# Altium schematic sheet BREADBOARD_MATTRIX.SchDoc
size A2; SheetNumber: 3; SheetTotal: 15
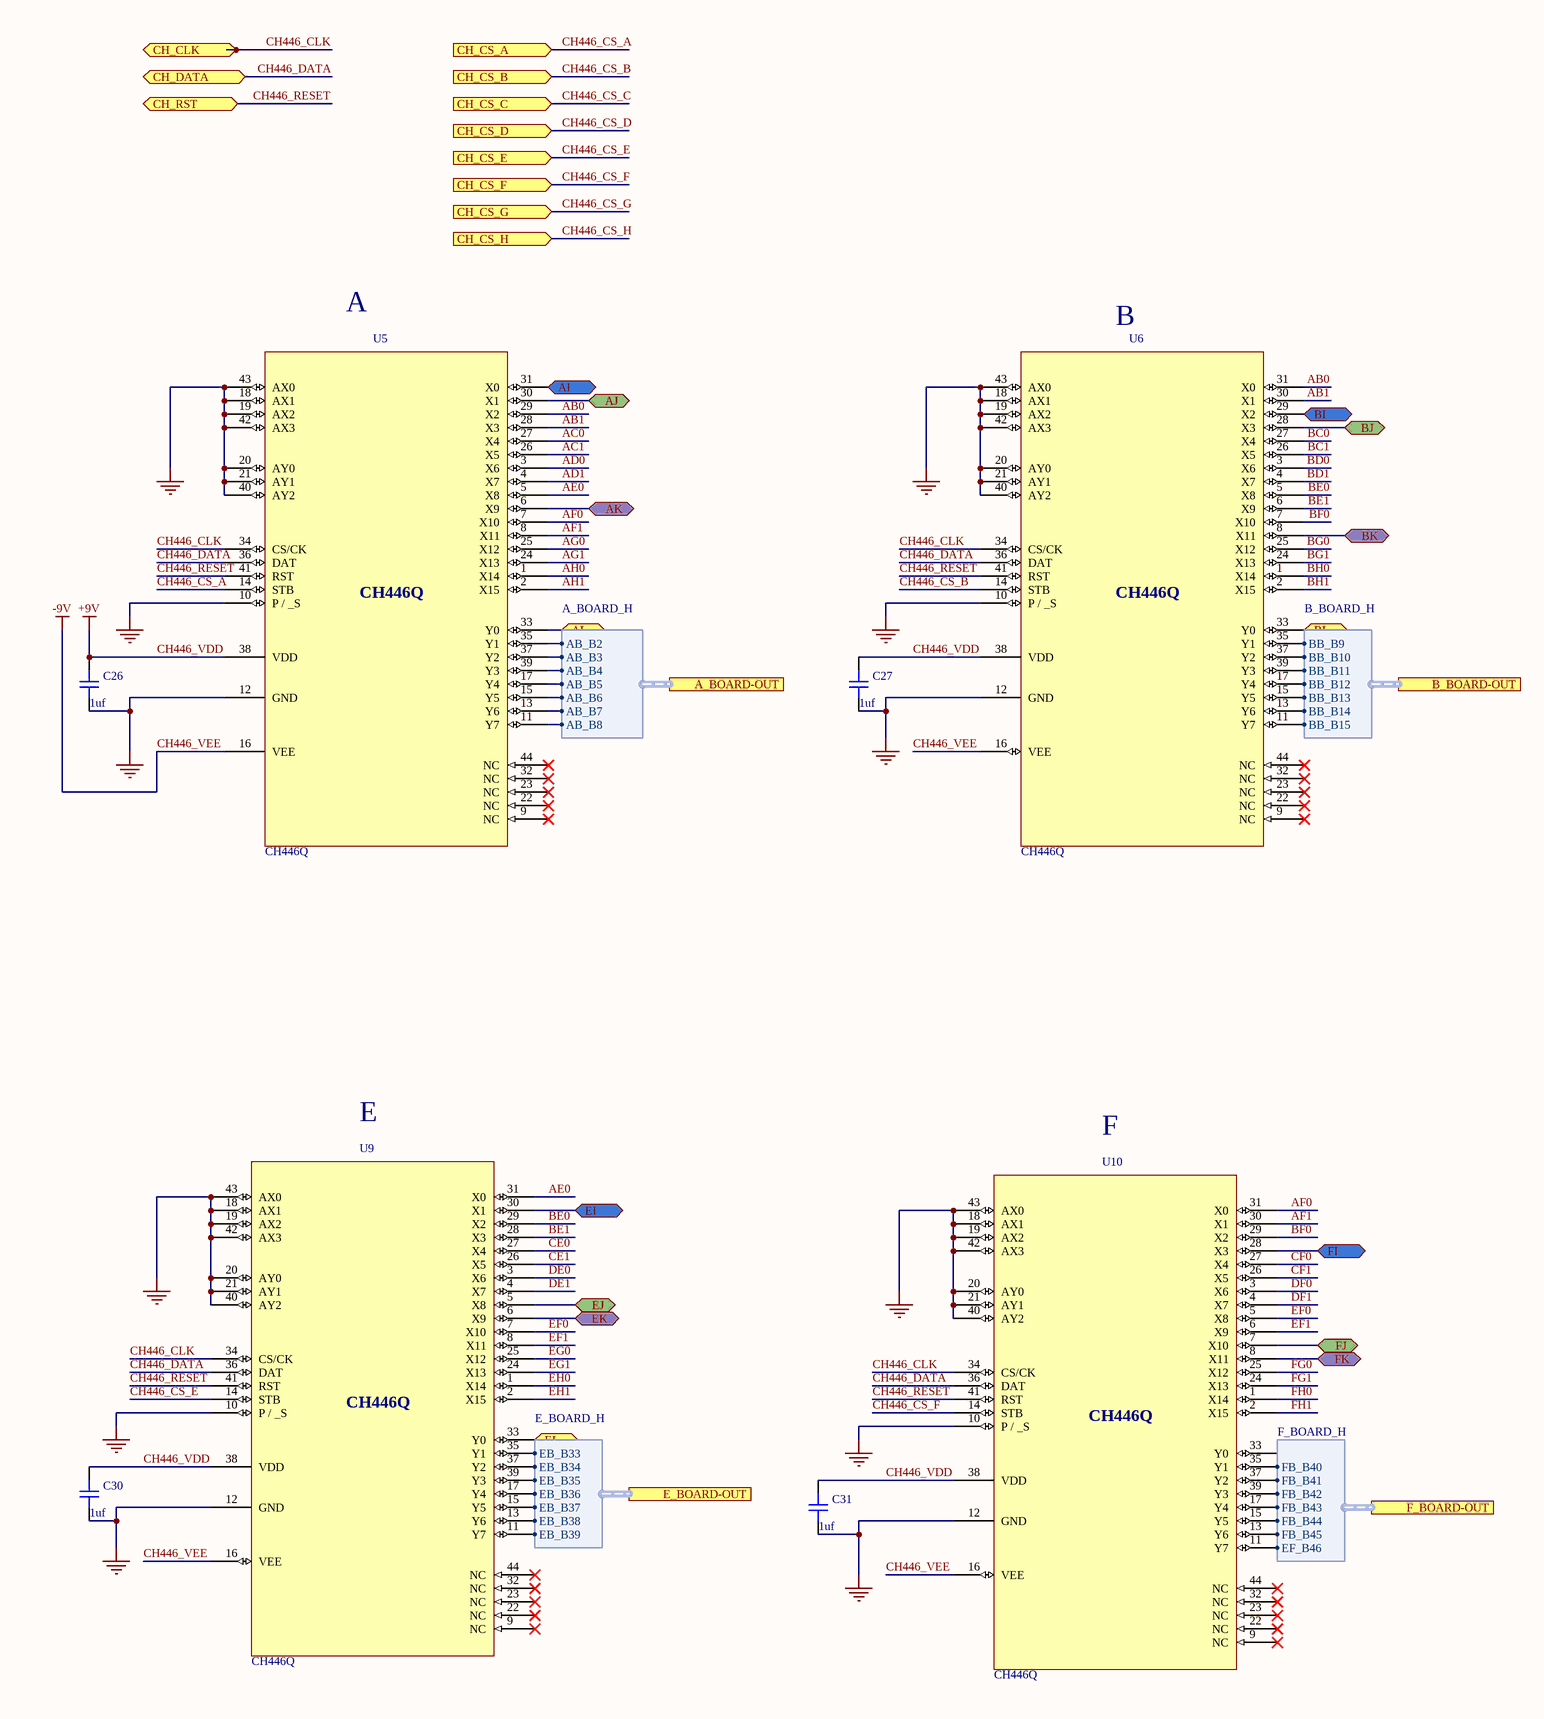
[diagram p0: BREADBOARD_MATTRIX.SchDoc, left]
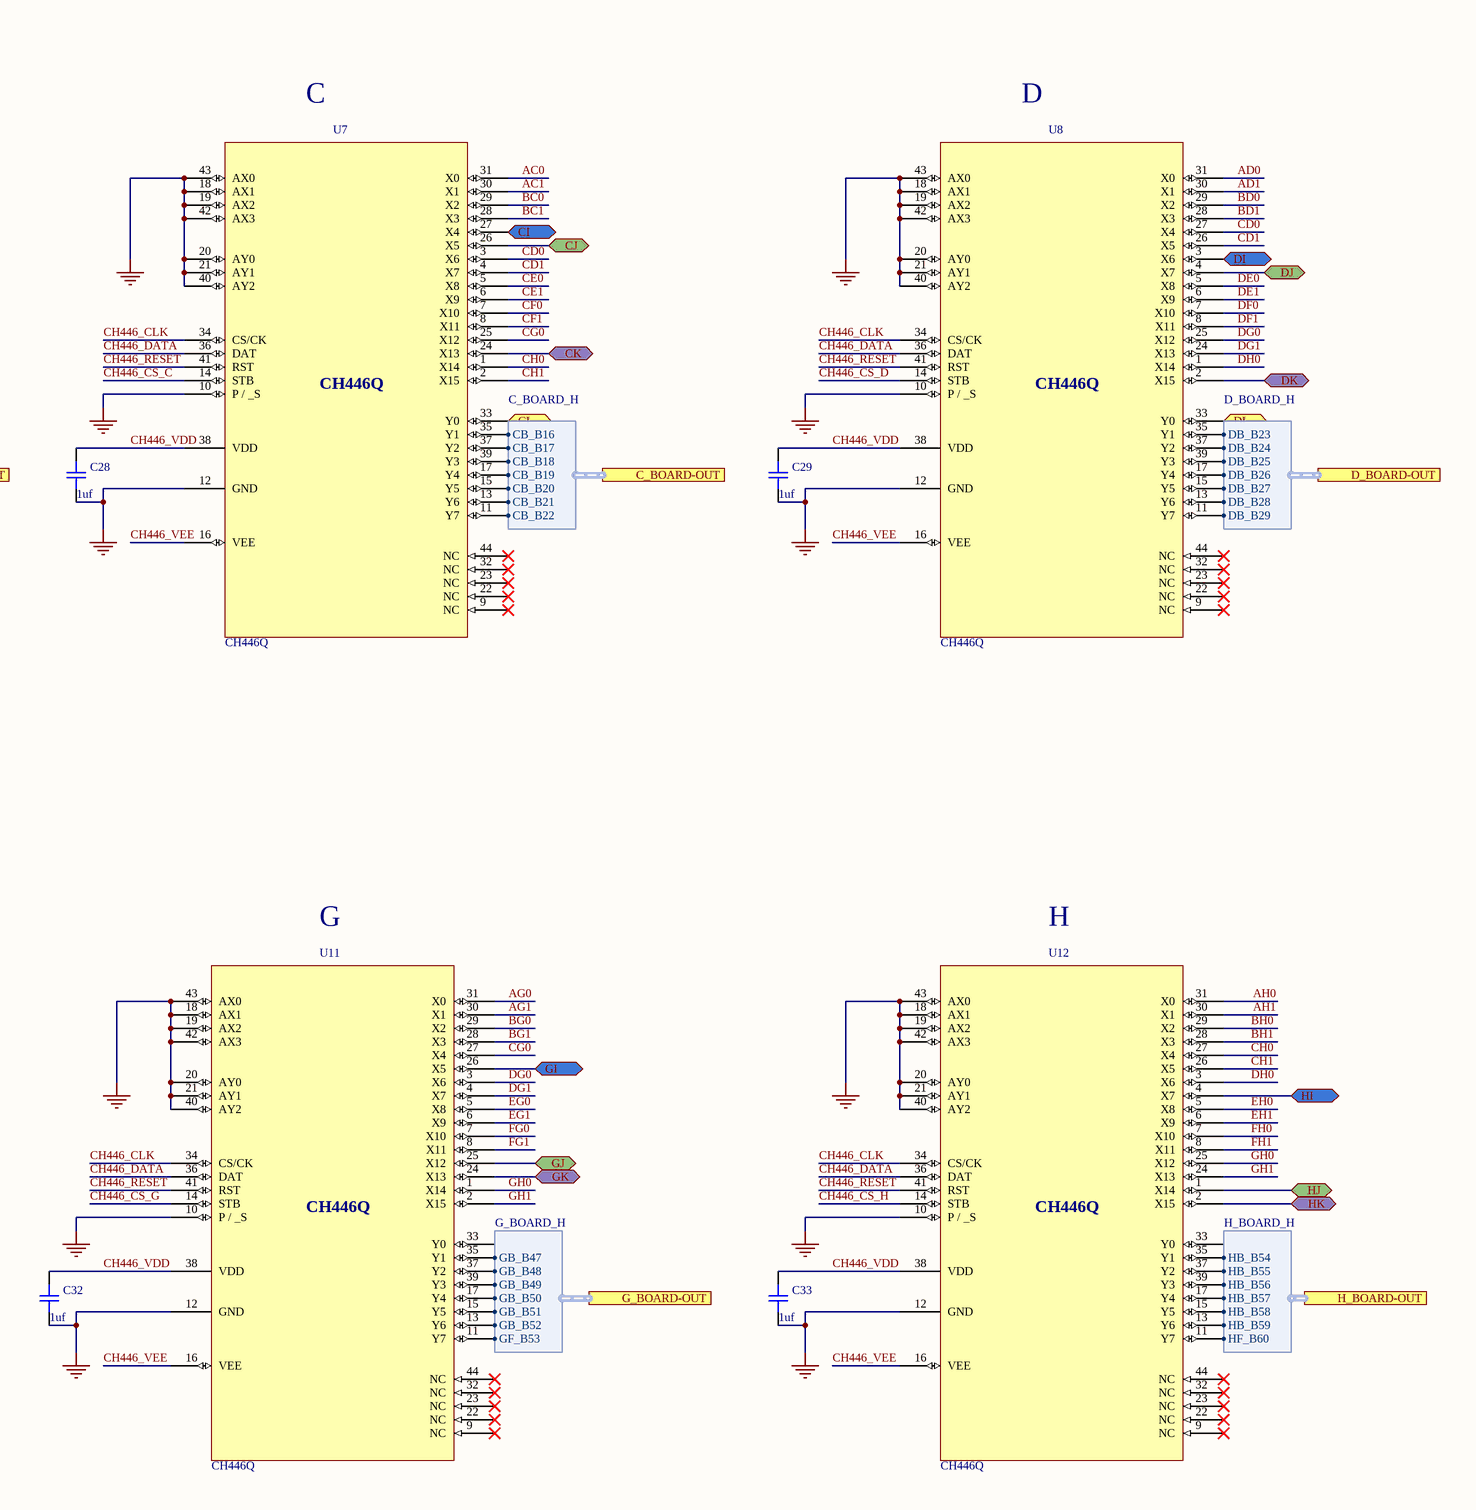
[diagram p1: BREADBOARD_MATTRIX.SchDoc, right]

## Parts
C26  1uf  [CAP_0603]
C27  1uf  [CAP_0603]
C28  1uf  [CAP_0603]
C29  1uf  [CAP_0603]
C30  1uf  [CAP_0603]
C31  1uf  [CAP_0603]
C32  1uf  [CAP_0603]
C33  1uf  [CAP_0603]
U5  CH446Q  [PG-LQFP-44]
U6  CH446Q  [PG-LQFP-44]
U7  CH446Q  [PG-LQFP-44]
U8  CH446Q  [PG-LQFP-44]
U9  CH446Q  [PG-LQFP-44]
U10  CH446Q  [PG-LQFP-44]
U11  CH446Q  [PG-LQFP-44]
U12  CH446Q  [PG-LQFP-44]

## Ports
A_BOARD-OUT (harness A_BOARD_H), AI (bidir), AJ (bidir), AK (bidir), AL (bidir), B_BOARD-OUT (harness B_BOARD_H), BI (bidir), BJ (bidir), BK (bidir), BL (bidir), C_BOARD-OUT (harness C_BOARD_H), CH_CLK (bidir), CH_CS_A (in), CH_CS_B (in), CH_CS_C (in), CH_CS_D (in), CH_CS_E (in), CH_CS_F (in), CH_CS_G (in), CH_CS_H (in), CH_DATA (bidir), CH_RST (bidir), CI (bidir), CJ (bidir), CK (bidir), CL (bidir), D_BOARD-OUT (harness D_BOARD_H), DI (bidir), DJ (bidir), DK (bidir), DL (bidir), E_BOARD-OUT (harness E_BOARD_H), EI (bidir), EJ (bidir), EK (bidir), EL (bidir), F_BOARD-OUT (harness F_BOARD_H), FI (bidir), FJ (bidir), FK (bidir), FL (bidir), G_BOARD-OUT (harness G_BOARD_H), GI (bidir), GJ (bidir), GK (bidir), GL (bidir), H_BOARD-OUT (harness H_BOARD_H), HI (bidir), HJ (bidir), HK (bidir), HL (bidir)

## Harnesses
A_BOARD_H: AB_B2, AB_B3, AB_B4, AB_B5, AB_B6, AB_B7, AB_B8
B_BOARD_H: BB_B9, BB_B10, BB_B11, BB_B12, BB_B13, BB_B14, BB_B15
C_BOARD_H: CB_B16, CB_B17, CB_B18, CB_B19, CB_B20, CB_B21, CB_B22
D_BOARD_H: DB_B23, DB_B24, DB_B25, DB_B26, DB_B27, DB_B28, DB_B29
E_BOARD_H: EB_B33, EB_B34, EB_B35, EB_B36, EB_B37, EB_B38, EB_B39
F_BOARD_H: FB_B40, FB_B41, FB_B42, FB_B43, FB_B44, FB_B45, EF_B46
G_BOARD_H: GB_B47, GB_B48, GB_B49, GB_B50, GB_B51, GB_B52, GF_B53
H_BOARD_H: HB_B54, HB_B55, HB_B56, HB_B57, HB_B58, HB_B59, HF_B60

## Nets
CH446_VDD: C26.2 C27.2 C28.2 C29.2 C30.2 C31.2 C32.2 C33.2 U5.38(VDD) U6.38(VDD) U7.38(VDD) U8.38(VDD) U9.38(VDD) U10.38(VDD) U11.38(VDD) U12.38(VDD)  [also labelled +9V]
CH446_VEE: U5.16(VEE) U6.16(VEE) U7.16(VEE) U8.16(VEE) U9.16(VEE) U10.16(VEE) U11.16(VEE) U12.16(VEE)  [also labelled -9V]
GND: C26.1 C27.1 C28.1 C29.1 C30.1 C31.1 C32.1 C33.1 U5.10(P_/__S) U5.12(GND) U5.18(AX1) U5.19(AX2) U5.20(AY0) U5.21(AY1) U5.40(AY2) U5.42(AX3) U5.43(AX0) U6.10(P_/__S) U6.12(GND) U6.18(AX1) U6.19(AX2) U6.20(AY0) U6.21(AY1) U6.40(AY2) U6.42(AX3) U6.43(AX0) U7.10(P_/__S) U7.12(GND) U7.18(AX1) U7.19(AX2) U7.20(AY0) U7.21(AY1) U7.40(AY2) U7.42(AX3) U7.43(AX0) U8.10(P_/__S) U8.12(GND) U8.18(AX1) U8.19(AX2) U8.20(AY0) U8.21(AY1) U8.40(AY2) U8.42(AX3) U8.43(AX0) U9.10(P_/__S) U9.12(GND) U9.18(AX1) U9.19(AX2) U9.20(AY0) U9.21(AY1) U9.40(AY2) U9.42(AX3) U9.43(AX0) U10.10(P_/__S) U10.12(GND) U10.18(AX1) U10.19(AX2) U10.20(AY0) U10.21(AY1) U10.40(AY2) U10.42(AX3) U10.43(AX0) U11.10(P_/__S) U11.12(GND) U11.18(AX1) U11.19(AX2) U11.20(AY0) U11.21(AY1) U11.40(AY2) U11.42(AX3) U11.43(AX0) U12.10(P_/__S) U12.12(GND) U12.18(AX1) U12.19(AX2) U12.20(AY0) U12.21(AY1) U12.40(AY2) U12.42(AX3) U12.43(AX0)
AB0: U5.29(X2) U6.31(X0)
AB1: U5.28(X3) U6.30(X1)
AC0: U5.27(X4) U7.31(X0)
AC1: U5.26(X5) U7.30(X1)
AD0: U5.3(X6) U8.31(X0)
AD1: U5.4(X7) U8.30(X1)
AE0: U5.5(X8) U9.31(X0)
AF0: U5.7(X10) U10.31(X0)
AF1: U5.8(X11) U10.30(X1)
AG0: U5.25(X12) U11.31(X0)
AG1: U5.24(X13) U11.30(X1)
AH0: U5.1(X14) U12.31(X0)
AH1: U5.2(X15) U12.30(X1)
AI: U5.31(X0) ; port AI
AJ: U5.30(X1) ; port AJ
AK: U5.6(X9) ; port AK
AL: U5.33(Y0) ; port AL
BC0: U6.27(X4) U7.29(X2)
BC1: U6.26(X5) U7.28(X3)
BD0: U6.3(X6) U8.29(X2)
BD1: U6.4(X7) U8.28(X3)
BE0: U6.5(X8) U9.29(X2)
BE1: U6.6(X9) U9.28(X3)
BF0: U6.7(X10) U10.29(X2)
BG0: U6.25(X12) U11.29(X2)
BG1: U6.24(X13) U11.28(X3)
BH0: U6.1(X14) U12.29(X2)
BH1: U6.2(X15) U12.28(X3)
BI: U6.29(X2) ; port BI
BJ: U6.28(X3) ; port BJ
BK: U6.8(X11) ; port BK
BL: U6.33(Y0) ; port BL
CD0: U7.3(X6) U8.27(X4)
CD1: U7.4(X7) U8.26(X5)
CE0: U7.5(X8) U9.27(X4)
CE1: U7.6(X9) U9.26(X5)
CF0: U7.7(X10) U10.27(X4)
CF1: U7.8(X11) U10.26(X5)
CG0: U7.25(X12) U11.27(X4)
CH0: U7.1(X14) U12.27(X4)
CH1: U7.2(X15) U12.26(X5)
CH446_CLK: U5.34(CS/CK) U6.34(CS/CK) U7.34(CS/CK) U8.34(CS/CK) U9.34(CS/CK) U10.34(CS/CK) U11.34(CS/CK) U12.34(CS/CK) ; port CH_CLK
CH446_CS_A: U5.14(STB) ; port CH_CS_A
CH446_CS_B: U6.14(STB) ; port CH_CS_B
CH446_CS_C: U7.14(STB) ; port CH_CS_C
CH446_CS_D: U8.14(STB) ; port CH_CS_D
CH446_CS_E: U9.14(STB) ; port CH_CS_E
CH446_CS_F: U10.14(STB) ; port CH_CS_F
CH446_CS_G: U11.14(STB) ; port CH_CS_G
CH446_CS_H: U12.14(STB) ; port CH_CS_H
CH446_DATA: U5.36(DAT) U6.36(DAT) U7.36(DAT) U8.36(DAT) U9.36(DAT) U10.36(DAT) U11.36(DAT) U12.36(DAT) ; port CH_DATA
CH446_RESET: U5.41(RST) U6.41(RST) U7.41(RST) U8.41(RST) U9.41(RST) U10.41(RST) U11.41(RST) U12.41(RST) ; port CH_RST
CI: U7.27(X4) ; port CI
CJ: U7.26(X5) ; port CJ
CK: U7.24(X13) ; port CK
CL: U7.33(Y0) ; port CL
DE0: U8.5(X8) U9.3(X6)
DE1: U8.6(X9) U9.4(X7)
DF0: U8.7(X10) U10.3(X6)
DF1: U8.8(X11) U10.4(X7)
DG0: U8.25(X12) U11.3(X6)
DG1: U8.24(X13) U11.4(X7)
DH0: U8.1(X14) U12.3(X6)
DI: U8.3(X6) ; port DI
DJ: U8.4(X7) ; port DJ
DK: U8.2(X15) ; port DK
DL: U8.33(Y0) ; port DL
EF0: U9.7(X10) U10.5(X8)
EF1: U9.8(X11) U10.6(X9)
EG0: U9.25(X12) U11.5(X8)
EG1: U9.24(X13) U11.6(X9)
EH0: U9.1(X14) U12.5(X8)
EH1: U9.2(X15) U12.6(X9)
EI: U9.30(X1) ; port EI
EJ: U9.5(X8) ; port EJ
EK: U9.6(X9) ; port EK
EL: U9.33(Y0) ; port EL
FG0: U10.25(X12) U11.7(X10)
FG1: U10.24(X13) U11.8(X11)
FH0: U10.1(X14) U12.7(X10)
FH1: U10.2(X15) U12.8(X11)
FI: U10.28(X3) ; port FI
FJ: U10.7(X10) ; port FJ
FK: U10.8(X11) ; port FK
FL: U10.33(Y0) ; port FL
GH0: U11.1(X14) U12.25(X12)
GH1: U11.2(X15) U12.24(X13)
GI: U11.26(X5) ; port GI
GJ: U11.25(X12) ; port GJ
GK: U11.24(X13) ; port GK
GL: U11.33(Y0) ; port GL
HI: U12.4(X7) ; port HI
HJ: U12.1(X14) ; port HJ
HK: U12.2(X15) ; port HK
HL: U12.33(Y0) ; port HL
NetU5_11: U5.11(Y7) ; port A_BOARD-OUT.AB_B8
NetU5_13: U5.13(Y6) ; port A_BOARD-OUT.AB_B7
NetU5_15: U5.15(Y5) ; port A_BOARD-OUT.AB_B6
NetU5_17: U5.17(Y4) ; port A_BOARD-OUT.AB_B5
NetU5_35: U5.35(Y1) ; port A_BOARD-OUT.AB_B2
NetU5_37: U5.37(Y2) ; port A_BOARD-OUT.AB_B3
NetU5_39: U5.39(Y3) ; port A_BOARD-OUT.AB_B4
NetU6_11: U6.11(Y7) ; port B_BOARD-OUT.BB_B15
NetU6_13: U6.13(Y6) ; port B_BOARD-OUT.BB_B14
NetU6_15: U6.15(Y5) ; port B_BOARD-OUT.BB_B13
NetU6_17: U6.17(Y4) ; port B_BOARD-OUT.BB_B12
NetU6_35: U6.35(Y1) ; port B_BOARD-OUT.BB_B9
NetU6_37: U6.37(Y2) ; port B_BOARD-OUT.BB_B10
NetU6_39: U6.39(Y3) ; port B_BOARD-OUT.BB_B11
NetU7_11: U7.11(Y7) ; port C_BOARD-OUT.CB_B22
NetU7_13: U7.13(Y6) ; port C_BOARD-OUT.CB_B21
NetU7_15: U7.15(Y5) ; port C_BOARD-OUT.CB_B20
NetU7_17: U7.17(Y4) ; port C_BOARD-OUT.CB_B19
NetU7_35: U7.35(Y1) ; port C_BOARD-OUT.CB_B16
NetU7_37: U7.37(Y2) ; port C_BOARD-OUT.CB_B17
NetU7_39: U7.39(Y3) ; port C_BOARD-OUT.CB_B18
NetU8_11: U8.11(Y7) ; port D_BOARD-OUT.DB_B29
NetU8_13: U8.13(Y6) ; port D_BOARD-OUT.DB_B28
NetU8_15: U8.15(Y5) ; port D_BOARD-OUT.DB_B27
NetU8_17: U8.17(Y4) ; port D_BOARD-OUT.DB_B26
NetU8_35: U8.35(Y1) ; port D_BOARD-OUT.DB_B23
NetU8_37: U8.37(Y2) ; port D_BOARD-OUT.DB_B24
NetU8_39: U8.39(Y3) ; port D_BOARD-OUT.DB_B25
NetU9_11: U9.11(Y7) ; port E_BOARD-OUT.EB_B39
NetU9_13: U9.13(Y6) ; port E_BOARD-OUT.EB_B38
NetU9_15: U9.15(Y5) ; port E_BOARD-OUT.EB_B37
NetU9_17: U9.17(Y4) ; port E_BOARD-OUT.EB_B36
NetU9_35: U9.35(Y1) ; port E_BOARD-OUT.EB_B33
NetU9_37: U9.37(Y2) ; port E_BOARD-OUT.EB_B34
NetU9_39: U9.39(Y3) ; port E_BOARD-OUT.EB_B35
NetU10_11: U10.11(Y7) ; port F_BOARD-OUT.EF_B46
NetU10_13: U10.13(Y6) ; port F_BOARD-OUT.FB_B45
NetU10_15: U10.15(Y5) ; port F_BOARD-OUT.FB_B44
NetU10_17: U10.17(Y4) ; port F_BOARD-OUT.FB_B43
NetU10_35: U10.35(Y1) ; port F_BOARD-OUT.FB_B40
NetU10_37: U10.37(Y2) ; port F_BOARD-OUT.FB_B41
NetU10_39: U10.39(Y3) ; port F_BOARD-OUT.FB_B42
NetU11_11: U11.11(Y7) ; port G_BOARD-OUT.GF_B53
NetU11_13: U11.13(Y6) ; port G_BOARD-OUT.GB_B52
NetU11_15: U11.15(Y5) ; port G_BOARD-OUT.GB_B51
NetU11_17: U11.17(Y4) ; port G_BOARD-OUT.GB_B50
NetU11_35: U11.35(Y1) ; port G_BOARD-OUT.GB_B47
NetU11_37: U11.37(Y2) ; port G_BOARD-OUT.GB_B48
NetU11_39: U11.39(Y3) ; port G_BOARD-OUT.GB_B49
NetU12_11: U12.11(Y7) ; port H_BOARD-OUT.HF_B60
NetU12_13: U12.13(Y6) ; port H_BOARD-OUT.HB_B59
NetU12_15: U12.15(Y5) ; port H_BOARD-OUT.HB_B58
NetU12_17: U12.17(Y4) ; port H_BOARD-OUT.HB_B57
NetU12_35: U12.35(Y1) ; port H_BOARD-OUT.HB_B54
NetU12_37: U12.37(Y2) ; port H_BOARD-OUT.HB_B55
NetU12_39: U12.39(Y3) ; port H_BOARD-OUT.HB_B56

Not connected (* = marked no-connect by the designer): U5 9(NC)* 22(NC)* 23(NC)* 32(NC)* 44(NC)*; U6 9(NC)* 22(NC)* 23(NC)* 32(NC)* 44(NC)*; U7 9(NC)* 22(NC)* 23(NC)* 32(NC)* 44(NC)*; U8 9(NC)* 22(NC)* 23(NC)* 32(NC)* 44(NC)*; U9 9(NC)* 22(NC)* 23(NC)* 32(NC)* 44(NC)*; U10 9(NC)* 22(NC)* 23(NC)* 32(NC)* 44(NC)*; U11 9(NC)* 22(NC)* 23(NC)* 32(NC)* 44(NC)*; U12 9(NC)* 22(NC)* 23(NC)* 32(NC)* 44(NC)*

## Notes on the sheet
- A
- B
- C
- D
- E
- F
- G
- H

## Library data of the parts
C26-C33 = CAP_0603: Capacitor SMD 0603; Manufacturer: *; Manufacturer Part Number: *; Distributor Link: *; LCSC: *; Rating: *; Dielectric: *